# Altium schematic sheet ExternalBalancing.SchDoc: Cell Balancing
size A3; DrawnBy: Sam Haines; DocumentNumber: 6; Revision: 01; SheetNumber: 6; SheetTotal: 10; Version: 01; Project: Battery Managment System 2020; PageSetup: Record=PageOptions|CenterHorizontal=True|CenterVertical=True|PrintScale=0.97|XCorrection=1.00|YCorrection=1.00|PrintKind=0|BorderSize=5000000|LeftOffset=0|BottomOffset=0|Orientation=2|PaperLength=1000|PaperWidth=1000|Scale=100|PaperSource=7|PrintQuality=-4|MediaType=1|DitherType=10|PaperKind=A4|PrintScaleMode=1
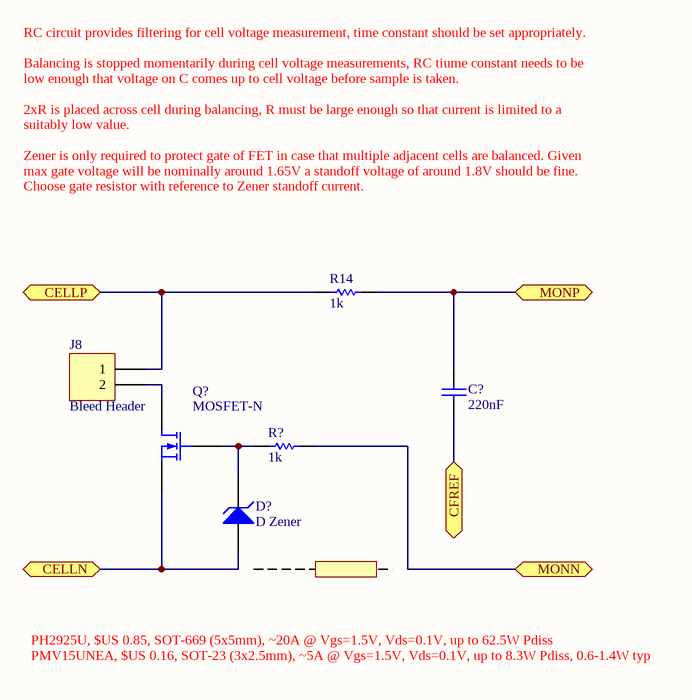
[diagram p0: ExternalBalancing.SchDoc]

## Parts
C?  220nF  [CAPC2013X145X50ML20T25]
D?  D Zener  [DIODE-0.7]
J8  Bleed Header  [HDR1X2]
Q?  MOSFET-N  [E3]
R14  1k  [RESC1608X55X30ML15T15]
R?  1k  [RESC1608X55X30ML15T15]

## Ports
CELLN (bidir), CELLP (bidir), CFREF (bidir), MONN (bidir), MONP (bidir)

## Nets
CELLN: D?.1(A) Q?.3(S) ; port CELLN
CELLP: J8.1 R14.1 ; port CELLP
CFREF: C?.1 ; port CFREF
MONN: R?.2 ; port MONN
MONP: C?.2 R14.2 ; port MONP
NetD?_2: D?.2(K) Q?.2(G) R?.1
NetJ8_2: J8.2 Q?.1(D)

## Notes on the sheet
- RC circuit provides filtering for cell voltage measurement, time constant should be set appropriately.
  Balancing is stopped momentarily during cell voltage measurements, RC tiume constant needs to be low enough that voltage on C comes up to cell voltage before sample is taken.
  2xR is placed across cell during balancing, R must be large enough so that current is limited to a suitably low value.
  Zener is only required to protect gate of FET in case that multiple adjacent cells are balanced. Given max gate voltage will be nominally around 1.65V a standoff voltage of around 1.8V should be fine. Choose gate resistor with reference to Zener standoff current.
- PH2925U, $US 0.85, SOT-669 (5x5mm), ~20A @ Vgs=1.5V, Vds=0.1V, up to 62.5W Pdiss
  PMV15UNEA, $US 0.16, SOT-23 (3x2.5mm), ~5A @ Vgs=1.5V, Vds=0.1V, up to 8.3W Pdiss, 0.6-1.4W typ
- Revision History:
- Sheet Title:
- Rev
- Date
- Description
- Project:
- Size:
- Drawn By:
- A3
- Number:
- Revision:
- Sheet
- Version:
- of
- QUT Motorsport
- O-120, Gardens Point
- 2 George Street
- Brisbane, QLD 4000
- Australia
- Print Date:
- Print Time:
- File Name:

## Library data of the parts
C? = CMP-2007-01110-1: Part Number: C0805C224J5RACTU; Manufacturer: Kemet
D? = D Zener: Zener Diode; Published: 8-Jun-2000; LatestRevisionDate: 17-Jul-2002; LatestRevisionNote: Re-released for DXP Platform.; PackageReference: DIODE-0.7; Publisher: Altium Limited; PackageDescription: Diode, Thru-Hole; 2 Leads; 0.7 in Pin Spacing
J8 = Header 2: Header, 2-Pin; LatestRevisionDate: 17-Jul-2002; LatestRevisionNote: Re-released for DXP Platform.; Publisher: Altium Limited
Q? = MOSFET-N: N-Channel MOSFET; Published: 8-Jun-2000; LatestRevisionDate: 17-Jul-2002; LatestRevisionNote: Re-released for DXP Platform.; PackageVersion: 1995/1996; PackageReference: E3; Publisher: Altium Limited; PackageDescription: TO, Flat Index; 3 In-Line, Axial Leads; Body Dia. 4.6mm; Lead Dia. 0.5 mm (max)
R14 R? = CMP-2000-00703-1: Part Number: ERJ-3GEYJ102V; Manufacturer: Panasonic